# Altium schematic sheet Flow_sensor.SchDoc
size 420 x 297 mm; Address1: Address1; Address2: Address2; Address3: Address3; Address4: Address4; DocumentNumber: *Э3; SheetNumber: 11; SheetTotal: 11; DocumentType: Схема электрическая *
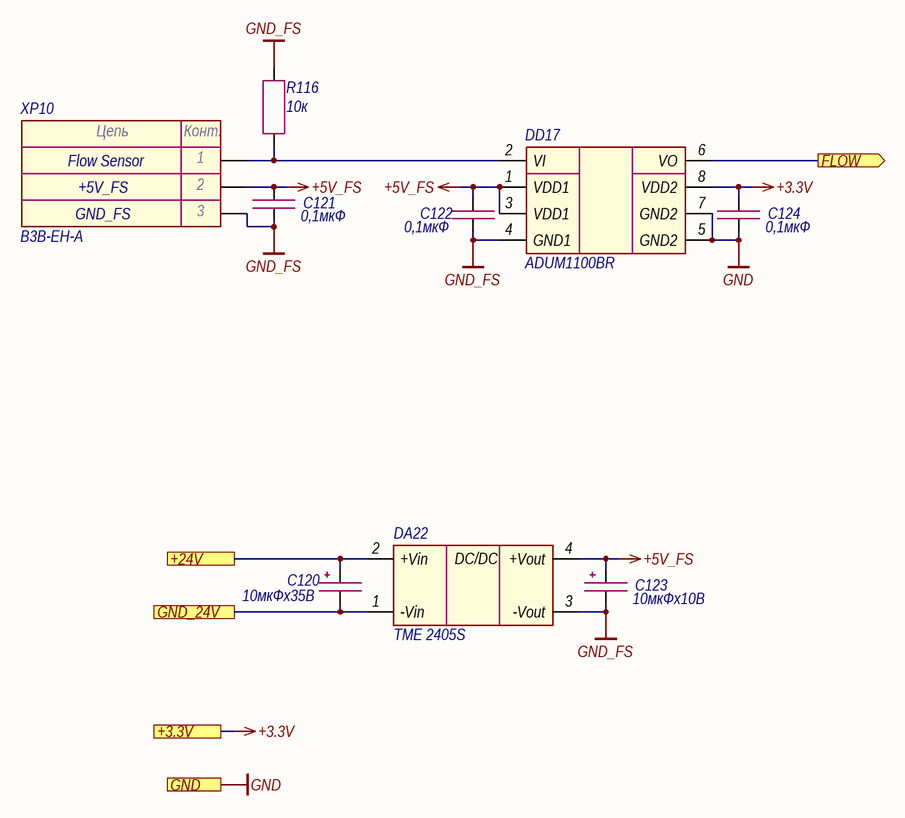
[diagram p0: Flow_sensor.SchDoc]

## Parts
C120  10мкФх35B  [CAP_C]
C121  0,1мкФ  [CAP_0603]
C122  0,1мкФ  [CAP_0603]
C123  10мкФх10B  [CAP_A]
C124  0,1мкФ  [CAP_0603]
DA22  TME 2405S  [TME (SIP-4)]
DD17  ADUM1100BR  [SOIC-8]
R116  10к  [RES_0603]
XP10  B3B-EH-A  [B3B-EH-A]

## Ports
+3.3V (see Main[3C], Ethernet[3D], Fiber_interlock[2C], Hardwiring[3D], LD_driver[1D], Power_supply[1D]), +24V (see Main[2C], Hardwiring[3C], Indication[1C], LD_driver[1D], Power_supply[1D]), FLOW (out, see Main[3C]), GND (see Main[3C], Ethernet[3D], Fiber_interlock[2C], Guide_laser[1C], Hardwiring[3D], Indication[1C], LD_driver[1D], Power_supply[1D]), GND_24V (see Main[2C], Hardwiring[3C], Indication[1C], LD_driver[1D], Power_supply[1D])

## Nets
+3.3V: C124.1 DD17.8(VDD2) ; port +3.3V
+5V_FS: C121.1 C122.1 C123.1 DA22.4(+Vout) DD17.1(VDD1) DD17.3(VDD1) XP10.2
GND: C124.2 DD17.5(GND2) DD17.7(GND2) ; port GND
GND_FS: C121.2 C122.2 C123.2 DA22.3(-Vout) DD17.4(GND1) R116.2 XP10.3
+24V: C120.1 DA22.2(+Vin) ; port +24V
FLOW: DD17.6(VO) ; port FLOW
GND_24V: C120.2 DA22.1(-Vin) ; port GND_24V
NetDD17_2: DD17.2(VI) R116.1 XP10.1

## Notes on the sheet
- +5V_FS
- Flow Sensor
- GND_FS
- Подп. и дата
- Инв. № дубл.
- Взам. инв. №
- Инв. № подл.
- Изм.
- Лист
- № докум.
- Подп.
- Дата
- Копировал
- Формат А3
- (in symbol Connector-3) Цепь; Конт.
- (in symbol TME) DC/DC

## Library data of the parts
C120 = Capacitor_Polar: Model: TECAP, 10 мкФ, 35 В, тип C, 10%; Value: 10мкФх35B; Document: *; Manufacturer: *
C121 C122 C124 = Capacitor: Manufacturer: Murata; Model: GRM188R71H104KA93D; Value: 0,1мкФ; Document: *
C123 = Capacitor_Polar: Model: TECAP, 10 мкФ, 10 В, тип A, 10%; Value: 10мкФх10B; Document: *; Manufacturer: *
DA22 = TME: Manufacturer: Traco Power; Model: TME 2405S; Document: *
DD17 = ADUM1100: Manufacturer: Analog Devices; Model: ADUM1100BR; Document: *
R116 = Resistor: Manufacturer: Yageo; Model: RC0603FR-0710KL; Value: 10к; Document: *
XP10 = Connector-3: Manufacturer: JST; Model: B3B-EH-A; Document: *